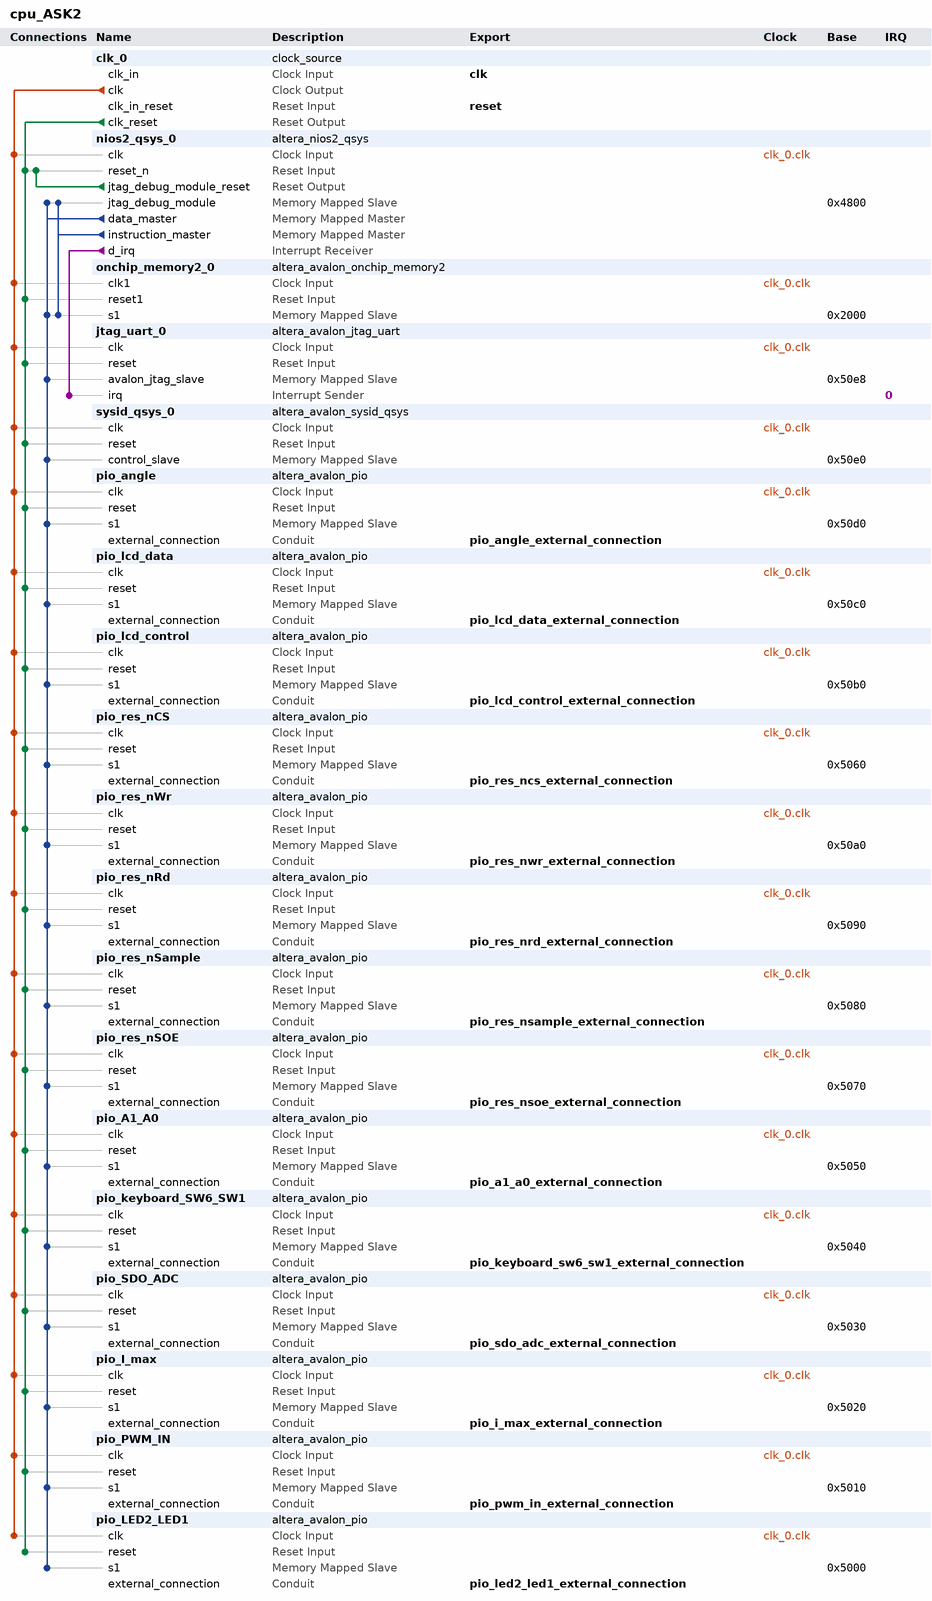
[diagram p0: system contents]
# Platform Designer (Qsys) system cpu_ASK2, Cyclone III EP3C25E144I7
# Parameters at their usual value, and those the tool derives, are not listed.
package require -exact qsys 13.0.1
create_system cpu_ASK2
set_project_property DEVICE_FAMILY {Cyclone III}
set_project_property DEVICE EP3C25E144I7

add_instance clk_0 clock_source 13.0
set_instance_parameter_value clk_0 clockFrequency 50000000

add_instance nios2_qsys_0 altera_nios2_qsys 13.0
set_instance_parameter_value nios2_qsys_0 resetSlave onchip_memory2_0.s1
set_instance_parameter_value nios2_qsys_0 mmu_TLBMissExcSlave None
set_instance_parameter_value nios2_qsys_0 exceptionSlave onchip_memory2_0.s1
set_instance_parameter_value nios2_qsys_0 breakSlave nios2_qsys_0.jtag_debug_module
set_instance_parameter_value nios2_qsys_0 impl Small
set_instance_parameter_value nios2_qsys_0 icache_size 4096

add_instance onchip_memory2_0 altera_avalon_onchip_memory2 13.0.1
set_instance_parameter_value onchip_memory2_0 dataWidth 32
set_instance_parameter_value onchip_memory2_0 dualPort false
set_instance_parameter_value onchip_memory2_0 initMemContent true
set_instance_parameter_value onchip_memory2_0 initializationFileName onchip_mem.hex
set_instance_parameter_value onchip_memory2_0 memorySize 8096

add_instance jtag_uart_0 altera_avalon_jtag_uart 13.0.1
set_instance_parameter_value jtag_uart_0 simInteractiveOptions NO_INTERACTIVE_WINDOWS

add_instance sysid_qsys_0 altera_avalon_sysid_qsys 13.0
set_instance_parameter_value sysid_qsys_0 id 21

add_instance pio_angle altera_avalon_pio 13.0.1
set_instance_parameter_value pio_angle direction Bidir
set_instance_parameter_value pio_angle width 16

add_instance pio_lcd_data altera_avalon_pio 13.0.1
set_instance_parameter_value pio_lcd_data direction Bidir
set_instance_parameter_value pio_lcd_data width 8

add_instance pio_lcd_control altera_avalon_pio 13.0.1
set_instance_parameter_value pio_lcd_control direction Output
set_instance_parameter_value pio_lcd_control width 3

add_instance pio_res_nCS altera_avalon_pio 13.0.1
set_instance_parameter_value pio_res_nCS direction Output
set_instance_parameter_value pio_res_nCS width 1

add_instance pio_res_nWr altera_avalon_pio 13.0.1
set_instance_parameter_value pio_res_nWr direction Output
set_instance_parameter_value pio_res_nWr width 1

add_instance pio_res_nRd altera_avalon_pio 13.0.1
set_instance_parameter_value pio_res_nRd direction Output
set_instance_parameter_value pio_res_nRd width 1

add_instance pio_res_nSample altera_avalon_pio 13.0.1
set_instance_parameter_value pio_res_nSample direction Output
set_instance_parameter_value pio_res_nSample width 1

add_instance pio_res_nSOE altera_avalon_pio 13.0.1
set_instance_parameter_value pio_res_nSOE direction Bidir
set_instance_parameter_value pio_res_nSOE width 1

add_instance pio_A1_A0 altera_avalon_pio 13.0.1
set_instance_parameter_value pio_A1_A0 direction Output
set_instance_parameter_value pio_A1_A0 width 2

add_instance pio_keyboard_SW6_SW1 altera_avalon_pio 13.0.1
set_instance_parameter_value pio_keyboard_SW6_SW1 direction Input
set_instance_parameter_value pio_keyboard_SW6_SW1 width 6

add_instance pio_SDO_ADC altera_avalon_pio 13.0.1
set_instance_parameter_value pio_SDO_ADC direction Input
set_instance_parameter_value pio_SDO_ADC width 16

add_instance pio_I_max altera_avalon_pio 13.0.1
set_instance_parameter_value pio_I_max direction Output
set_instance_parameter_value pio_I_max width 16

add_instance pio_PWM_IN altera_avalon_pio 13.0.1
set_instance_parameter_value pio_PWM_IN direction Output
set_instance_parameter_value pio_PWM_IN width 16

add_instance pio_LED2_LED1 altera_avalon_pio 13.0.1
set_instance_parameter_value pio_LED2_LED1 direction Output
set_instance_parameter_value pio_LED2_LED1 width 2

# connections
add_connection clk_0.clk jtag_uart_0.clk clock
add_connection clk_0.clk nios2_qsys_0.clk clock
add_connection clk_0.clk onchip_memory2_0.clk1 clock
add_connection clk_0.clk pio_A1_A0.clk clock
add_connection clk_0.clk pio_angle.clk clock
add_connection clk_0.clk pio_I_max.clk clock
add_connection clk_0.clk pio_keyboard_SW6_SW1.clk clock
add_connection clk_0.clk pio_lcd_control.clk clock
add_connection clk_0.clk pio_lcd_data.clk clock
add_connection clk_0.clk pio_LED2_LED1.clk clock
add_connection clk_0.clk pio_PWM_IN.clk clock
add_connection clk_0.clk pio_res_nCS.clk clock
add_connection clk_0.clk pio_res_nRd.clk clock
add_connection clk_0.clk pio_res_nSample.clk clock
add_connection clk_0.clk pio_res_nSOE.clk clock
add_connection clk_0.clk pio_res_nWr.clk clock
add_connection clk_0.clk pio_SDO_ADC.clk clock
add_connection clk_0.clk sysid_qsys_0.clk clock
add_connection clk_0.clk_reset jtag_uart_0.reset reset
add_connection clk_0.clk_reset nios2_qsys_0.reset_n reset
add_connection clk_0.clk_reset onchip_memory2_0.reset1 reset
add_connection clk_0.clk_reset pio_A1_A0.reset reset
add_connection clk_0.clk_reset pio_angle.reset reset
add_connection clk_0.clk_reset pio_I_max.reset reset
add_connection clk_0.clk_reset pio_keyboard_SW6_SW1.reset reset
add_connection clk_0.clk_reset pio_lcd_control.reset reset
add_connection clk_0.clk_reset pio_lcd_data.reset reset
add_connection clk_0.clk_reset pio_LED2_LED1.reset reset
add_connection clk_0.clk_reset pio_PWM_IN.reset reset
add_connection clk_0.clk_reset pio_res_nCS.reset reset
add_connection clk_0.clk_reset pio_res_nRd.reset reset
add_connection clk_0.clk_reset pio_res_nSample.reset reset
add_connection clk_0.clk_reset pio_res_nSOE.reset reset
add_connection clk_0.clk_reset pio_res_nWr.reset reset
add_connection clk_0.clk_reset pio_SDO_ADC.reset reset
add_connection clk_0.clk_reset sysid_qsys_0.reset reset
add_connection nios2_qsys_0.jtag_debug_module_reset nios2_qsys_0.reset_n reset
add_connection nios2_qsys_0.data_master jtag_uart_0.avalon_jtag_slave avalon
set_connection_parameter_value nios2_qsys_0.data_master/jtag_uart_0.avalon_jtag_slave baseAddress 0x50e8
add_connection nios2_qsys_0.data_master nios2_qsys_0.jtag_debug_module avalon
set_connection_parameter_value nios2_qsys_0.data_master/nios2_qsys_0.jtag_debug_module baseAddress 0x4800
add_connection nios2_qsys_0.data_master onchip_memory2_0.s1 avalon
set_connection_parameter_value nios2_qsys_0.data_master/onchip_memory2_0.s1 baseAddress 0x2000
add_connection nios2_qsys_0.data_master pio_A1_A0.s1 avalon
set_connection_parameter_value nios2_qsys_0.data_master/pio_A1_A0.s1 baseAddress 0x5050
add_connection nios2_qsys_0.data_master pio_angle.s1 avalon
set_connection_parameter_value nios2_qsys_0.data_master/pio_angle.s1 baseAddress 0x50d0
add_connection nios2_qsys_0.data_master pio_I_max.s1 avalon
set_connection_parameter_value nios2_qsys_0.data_master/pio_I_max.s1 baseAddress 0x5020
add_connection nios2_qsys_0.data_master pio_keyboard_SW6_SW1.s1 avalon
set_connection_parameter_value nios2_qsys_0.data_master/pio_keyboard_SW6_SW1.s1 baseAddress 0x5040
add_connection nios2_qsys_0.data_master pio_lcd_control.s1 avalon
set_connection_parameter_value nios2_qsys_0.data_master/pio_lcd_control.s1 baseAddress 0x50b0
add_connection nios2_qsys_0.data_master pio_lcd_data.s1 avalon
set_connection_parameter_value nios2_qsys_0.data_master/pio_lcd_data.s1 baseAddress 0x50c0
add_connection nios2_qsys_0.data_master pio_LED2_LED1.s1 avalon
set_connection_parameter_value nios2_qsys_0.data_master/pio_LED2_LED1.s1 baseAddress 0x5000
add_connection nios2_qsys_0.data_master pio_PWM_IN.s1 avalon
set_connection_parameter_value nios2_qsys_0.data_master/pio_PWM_IN.s1 baseAddress 0x5010
add_connection nios2_qsys_0.data_master pio_res_nCS.s1 avalon
set_connection_parameter_value nios2_qsys_0.data_master/pio_res_nCS.s1 baseAddress 0x5060
add_connection nios2_qsys_0.data_master pio_res_nRd.s1 avalon
set_connection_parameter_value nios2_qsys_0.data_master/pio_res_nRd.s1 baseAddress 0x5090
add_connection nios2_qsys_0.data_master pio_res_nSample.s1 avalon
set_connection_parameter_value nios2_qsys_0.data_master/pio_res_nSample.s1 baseAddress 0x5080
add_connection nios2_qsys_0.data_master pio_res_nSOE.s1 avalon
set_connection_parameter_value nios2_qsys_0.data_master/pio_res_nSOE.s1 baseAddress 0x5070
add_connection nios2_qsys_0.data_master pio_res_nWr.s1 avalon
set_connection_parameter_value nios2_qsys_0.data_master/pio_res_nWr.s1 baseAddress 0x50a0
add_connection nios2_qsys_0.data_master pio_SDO_ADC.s1 avalon
set_connection_parameter_value nios2_qsys_0.data_master/pio_SDO_ADC.s1 baseAddress 0x5030
add_connection nios2_qsys_0.data_master sysid_qsys_0.control_slave avalon
set_connection_parameter_value nios2_qsys_0.data_master/sysid_qsys_0.control_slave baseAddress 0x50e0
add_connection nios2_qsys_0.instruction_master nios2_qsys_0.jtag_debug_module avalon
set_connection_parameter_value nios2_qsys_0.instruction_master/nios2_qsys_0.jtag_debug_module baseAddress 0x4800
add_connection nios2_qsys_0.instruction_master onchip_memory2_0.s1 avalon
set_connection_parameter_value nios2_qsys_0.instruction_master/onchip_memory2_0.s1 baseAddress 0x2000
add_connection nios2_qsys_0.d_irq jtag_uart_0.irq interrupt
set_connection_parameter_value nios2_qsys_0.d_irq/jtag_uart_0.irq irqNumber 0

# exported interfaces
add_interface clk clock sink
set_interface_property clk EXPORT_OF clk_0.clk_in
add_interface reset reset sink
set_interface_property reset EXPORT_OF clk_0.clk_in_reset
add_interface pio_angle_external_connection conduit end
set_interface_property pio_angle_external_connection EXPORT_OF pio_angle.external_connection
add_interface pio_lcd_control_external_connection conduit end
set_interface_property pio_lcd_control_external_connection EXPORT_OF pio_lcd_control.external_connection
add_interface pio_lcd_data_external_connection conduit end
set_interface_property pio_lcd_data_external_connection EXPORT_OF pio_lcd_data.external_connection
add_interface pio_res_nwr_external_connection conduit end
set_interface_property pio_res_nwr_external_connection EXPORT_OF pio_res_nWr.external_connection
add_interface pio_res_nrd_external_connection conduit end
set_interface_property pio_res_nrd_external_connection EXPORT_OF pio_res_nRd.external_connection
add_interface pio_res_nsoe_external_connection conduit end
set_interface_property pio_res_nsoe_external_connection EXPORT_OF pio_res_nSOE.external_connection
add_interface pio_res_nsample_external_connection conduit end
set_interface_property pio_res_nsample_external_connection EXPORT_OF pio_res_nSample.external_connection
add_interface pio_res_ncs_external_connection conduit end
set_interface_property pio_res_ncs_external_connection EXPORT_OF pio_res_nCS.external_connection
add_interface pio_a1_a0_external_connection conduit end
set_interface_property pio_a1_a0_external_connection EXPORT_OF pio_A1_A0.external_connection
add_interface pio_sdo_adc_external_connection conduit end
set_interface_property pio_sdo_adc_external_connection EXPORT_OF pio_SDO_ADC.external_connection
add_interface pio_i_max_external_connection conduit end
set_interface_property pio_i_max_external_connection EXPORT_OF pio_I_max.external_connection
add_interface pio_keyboard_sw6_sw1_external_connection conduit end
set_interface_property pio_keyboard_sw6_sw1_external_connection EXPORT_OF pio_keyboard_SW6_SW1.external_connection
add_interface pio_led2_led1_external_connection conduit end
set_interface_property pio_led2_led1_external_connection EXPORT_OF pio_LED2_LED1.external_connection
add_interface pio_pwm_in_external_connection conduit end
set_interface_property pio_pwm_in_external_connection EXPORT_OF pio_PWM_IN.external_connection

set_interconnect_requirement {$system} qsys_mm.clockCrossingAdapter HANDSHAKE
set_interconnect_requirement {$system} qsys_mm.maxAdditionalLatency 1

save_system cpu_ASK2.qsys
